# Altium schematic sheet 07_mPCIe_5-8.SchDoc: mPCIe 5 - 8 (XTRX)
size A3; Organization: Lime Microsystems; Address1: Surrey Tech Centre; Address2: Guildford GU2 7YG; Address3: Surrey; Address4: United Kingdom; Revision: v1.0; SheetNumber: 7; SheetTotal: 11
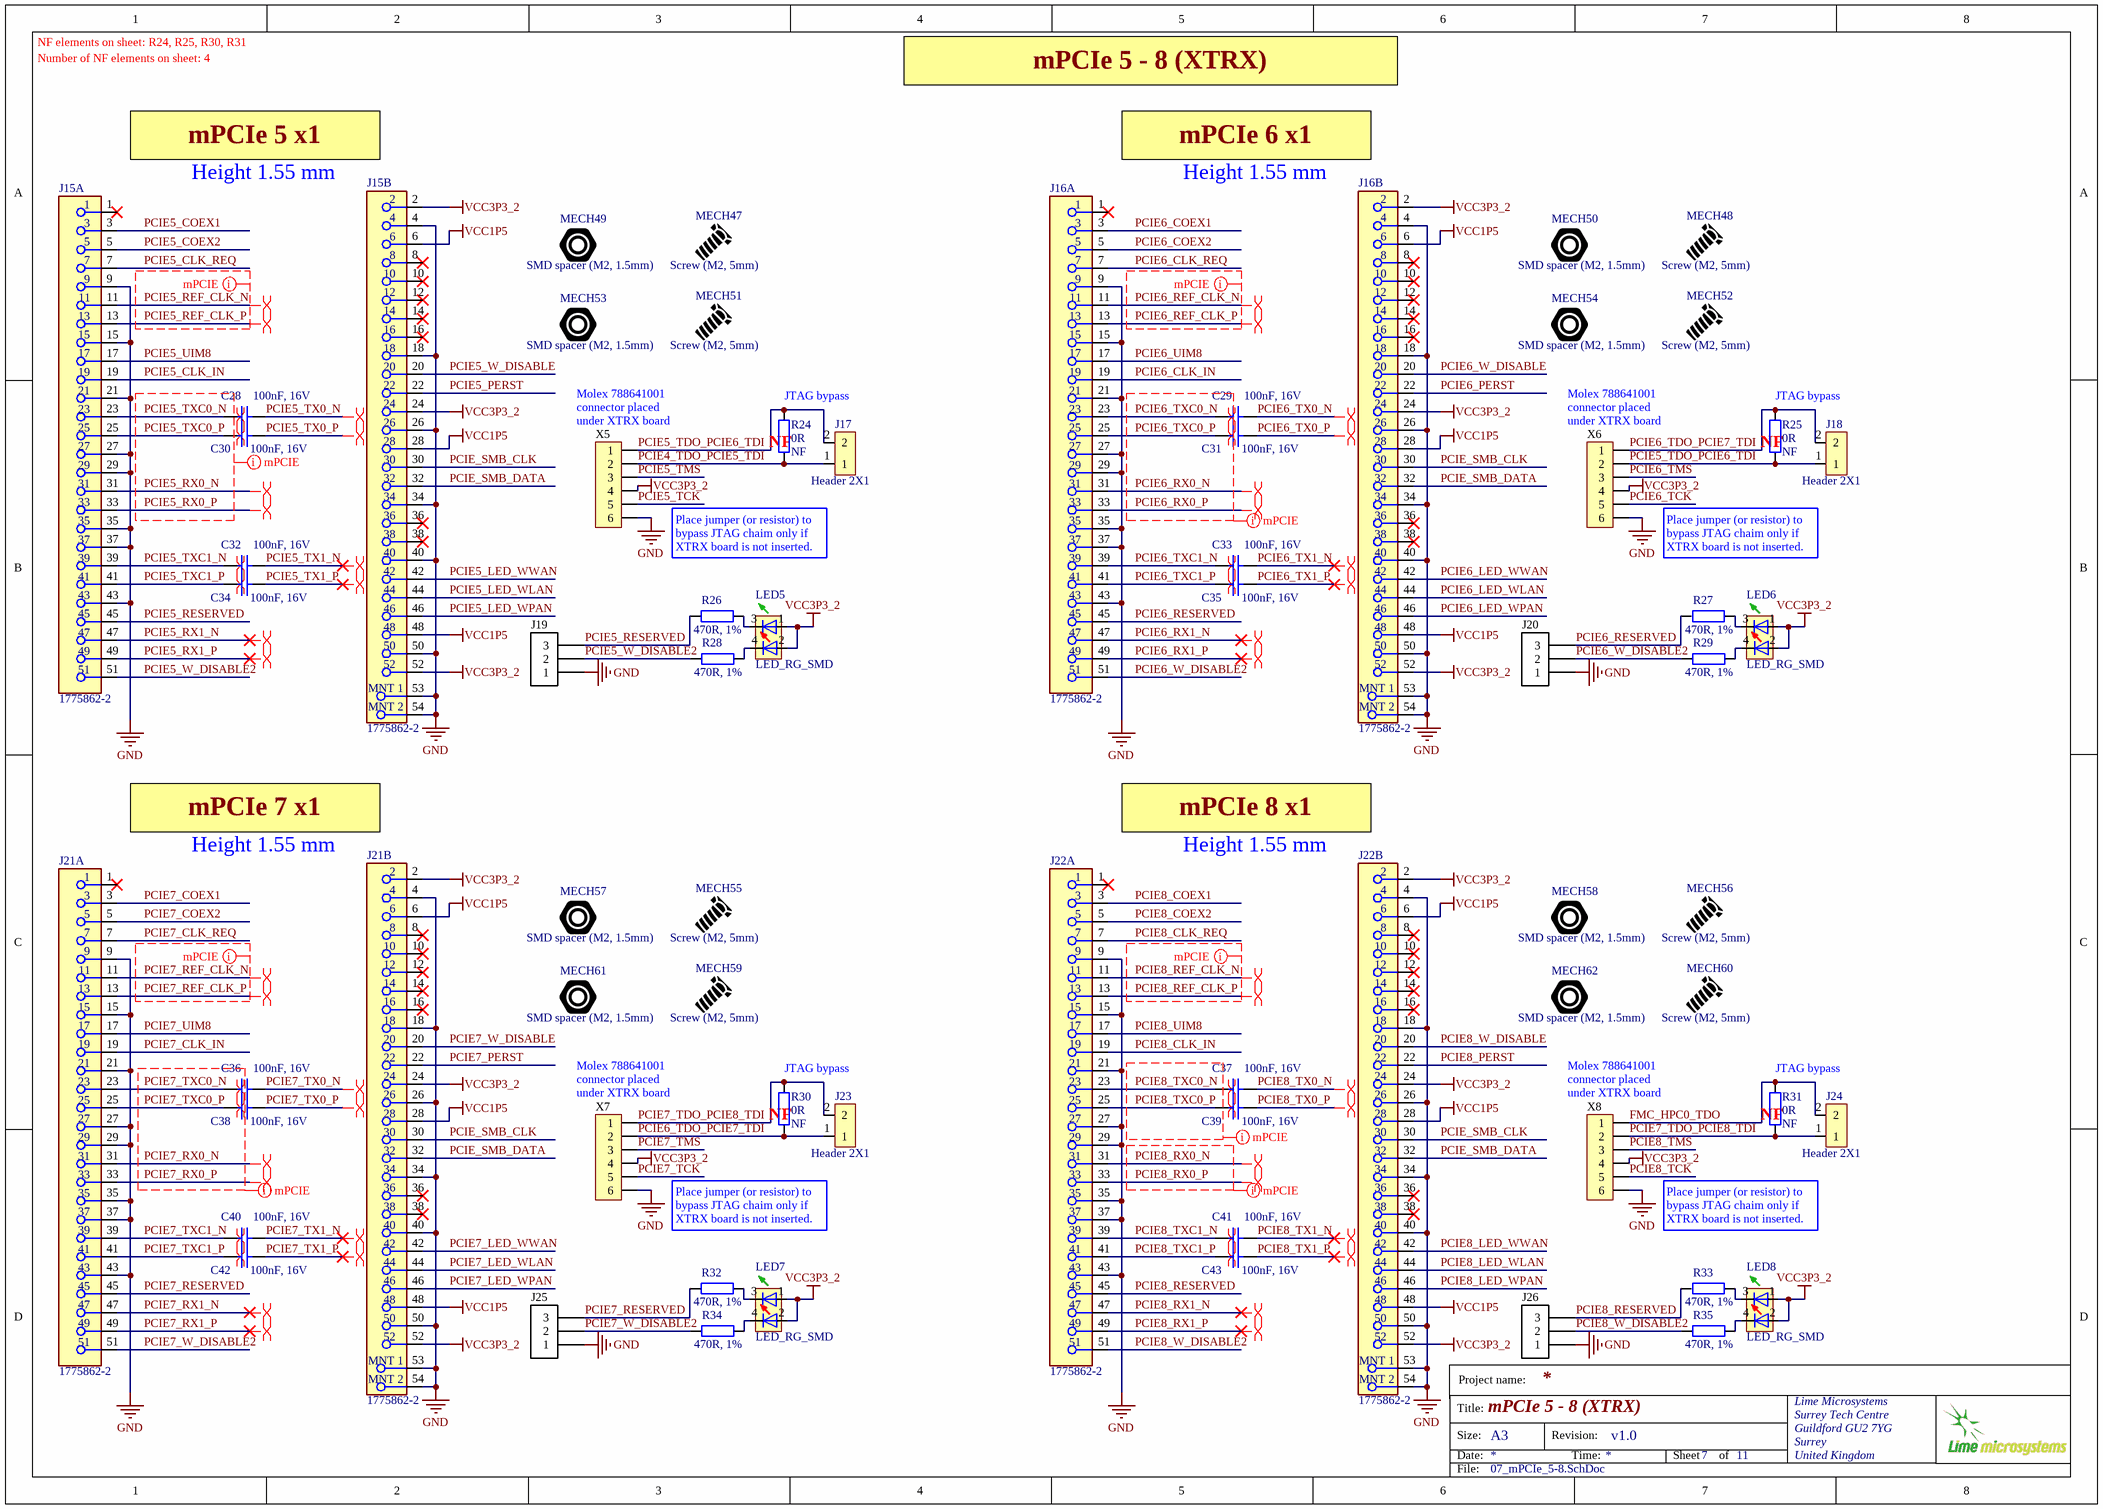
[diagram p0: 07_mPCIe_5-8.SchDoc]

## Parts
C28  100nF, 16V  [CAP0402]
C29  100nF, 16V  [CAP0402]
C30  100nF, 16V  [CAP0402]
C31  100nF, 16V  [CAP0402]
C32  100nF, 16V  [CAP0402]
C33  100nF, 16V  [CAP0402]
C34  100nF, 16V  [CAP0402]
C35  100nF, 16V  [CAP0402]
C36  100nF, 16V  [CAP0402]
C37  100nF, 16V  [CAP0402]
C38  100nF, 16V  [CAP0402]
C39  100nF, 16V  [CAP0402]
C40  100nF, 16V  [CAP0402]
C41  100nF, 16V  [CAP0402]
C42  100nF, 16V  [CAP0402]
C43  100nF, 16V  [CAP0402]
J15  1775862-2  [MiniPCIe_connector_XTRX]  (parts A,B of 2)
J16  1775862-2  [MiniPCIe_connector_XTRX]  (parts A,B of 2)
J17  Header 2X1  [HDR_1x2]
J18  Header 2X1  [HDR_1x2]
J19  Header 3x1 pin  [HDR_1x3]  (value not drawn)
J20  Header 3x1 pin  [HDR_1x3]  (value not drawn)
J21  1775862-2  [MiniPCIe_connector_XTRX]  (parts A,B of 2)
J22  1775862-2  [MiniPCIe_connector_XTRX]  (parts A,B of 2)
J23  Header 2X1  [HDR_1x2]
J24  Header 2X1  [HDR_1x2]
J25  Header 3x1 pin  [HDR_1x3]  (value not drawn)
J26  Header 3x1 pin  [HDR_1x3]  (value not drawn)
LED5  LED_RG_SMD  [LED-2x0603]
LED6  LED_RG_SMD  [LED-2x0603]
LED7  LED_RG_SMD  [LED-2x0603]
LED8  LED_RG_SMD  [LED-2x0603]
MECH47  Screw (M2, 5mm)  (mechanical)
MECH48  Screw (M2, 5mm)  (mechanical)
MECH49  SMD spacer (M2, 1.5mm)  (mechanical)
MECH50  SMD spacer (M2, 1.5mm)  (mechanical)
MECH51  Screw (M2, 5mm)  (mechanical)
MECH52  Screw (M2, 5mm)  (mechanical)
MECH53  SMD spacer (M2, 1.5mm)  (mechanical)
MECH54  SMD spacer (M2, 1.5mm)  (mechanical)
MECH55  Screw (M2, 5mm)  (mechanical)
MECH56  Screw (M2, 5mm)  (mechanical)
MECH57  SMD spacer (M2, 1.5mm)  (mechanical)
MECH58  SMD spacer (M2, 1.5mm)  (mechanical)
MECH59  Screw (M2, 5mm)  (mechanical)
MECH60  Screw (M2, 5mm)  (mechanical)
MECH61  SMD spacer (M2, 1.5mm)  (mechanical)
MECH62  SMD spacer (M2, 1.5mm)  (mechanical)
R24  0R  Assembly Info: NF  [RES0402]
R25  0R  Assembly Info: NF  [RES0402]
R26  470R, 1%  [RES0402]
R27  470R, 1%  [RES0402]
R28  470R, 1%  [RES0402]
R29  470R, 1%  [RES0402]
R30  0R  Assembly Info: NF  [RES0402]
R31  0R  Assembly Info: NF  [RES0402]
R32  470R, 1%  [RES0402]
R33  470R, 1%  [RES0402]
R34  470R, 1%  [RES0402]
R35  470R, 1%  [RES0402]
X5  Molex 0788641001  [Molex_0788641001_spring_contacts_carrier]  (value not drawn)
X6  Molex 0788641001  [Molex_0788641001_spring_contacts_carrier]  (value not drawn)
X7  Molex 0788641001  [Molex_0788641001_spring_contacts_carrier]  (value not drawn)
X8  Molex 0788641001  [Molex_0788641001_spring_contacts_carrier]  (value not drawn)

## Nets
GND: J15.4 J15.9 J15.15 J15.18 J15.21 J15.26 J15.27 J15.29 J15.34 J15.35 J15.37 J15.40 J15.43 J15.50 J15.53(MNT_1) J15.54(MNT_2) J16.4 J16.9 J16.15 J16.18 J16.21 J16.26 J16.27 J16.29 J16.34 J16.35 J16.37 J16.40 J16.43 J16.50 J16.53(MNT_1) J16.54(MNT_2) J19.1 J20.1 J21.4 J21.9 J21.15 J21.18 J21.21 J21.26 J21.27 J21.29 J21.34 J21.35 J21.37 J21.40 J21.43 J21.50 J21.53(MNT_1) J21.54(MNT_2) J22.4 J22.9 J22.15 J22.18 J22.21 J22.26 J22.27 J22.29 J22.34 J22.35 J22.37 J22.40 J22.43 J22.50 J22.53(MNT_1) J22.54(MNT_2) J25.1 J26.1 X5.6 X6.6 X7.6 X8.6
VCC1P5: J15.6 J15.28 J15.48 J16.6 J16.28 J16.48 J21.6 J21.28 J21.48 J22.6 J22.28 J22.48
VCC3P3_2: J15.2 J15.24 J15.52 J16.2 J16.24 J16.52 J21.2 J21.24 J21.52 J22.2 J22.24 J22.52 LED5.1 LED5.2 LED6.1 LED6.2 LED7.1 LED7.2 LED8.1 LED8.2 X5.4 X6.4 X7.4 X8.4
FMC_HPC0_TDO: J24.2 R31.1 X8.1
PCIE4_TDO_PCIE5_TDI: J17.1 R24.2 X5.2
PCIE5_CLK_IN: J15.19
PCIE5_CLK_REQ: J15.7
PCIE5_COEX1: J15.3
PCIE5_COEX2: J15.5
PCIE5_LED_WLAN: J15.44
PCIE5_LED_WPAN: J15.46
PCIE5_LED_WWAN: J15.42
PCIE5_PERST: J15.22
PCIE5_REF_CLK_N: J15.11
PCIE5_REF_CLK_P: J15.13
PCIE5_RESERVED: J15.45 J19.3 R26.2
PCIE5_RX0_N: J15.31
PCIE5_RX0_P: J15.33
PCIE5_RX1_N: J15.47
PCIE5_RX1_P: J15.49
PCIE5_TCK: X5.5
PCIE5_TDO_PCIE6_TDI: J17.2 J18.1 R24.1 R25.2 X5.1 X6.2
PCIE5_TMS: X5.3
PCIE5_TX0_N: C28.1
PCIE5_TX0_P: C30.1
PCIE5_TX1_N: C32.1
PCIE5_TX1_P: C34.1
PCIE5_TXC0_N: C28.2 J15.23
PCIE5_TXC0_P: C30.2 J15.25
PCIE5_TXC1_N: C32.2 J15.39
PCIE5_TXC1_P: C34.2 J15.41
PCIE5_UIM8: J15.17
PCIE5_W_DISABLE: J15.20
PCIE5_W_DISABLE2: J15.51 J19.2 R28.2
PCIE6_CLK_IN: J16.19
PCIE6_CLK_REQ: J16.7
PCIE6_COEX1: J16.3
PCIE6_COEX2: J16.5
PCIE6_LED_WLAN: J16.44
PCIE6_LED_WPAN: J16.46
PCIE6_LED_WWAN: J16.42
PCIE6_PERST: J16.22
PCIE6_REF_CLK_N: J16.11
PCIE6_REF_CLK_P: J16.13
PCIE6_RESERVED: J16.45 J20.3 R27.2
PCIE6_RX0_N: J16.31
PCIE6_RX0_P: J16.33
PCIE6_RX1_N: J16.47
PCIE6_RX1_P: J16.49
PCIE6_TCK: X6.5
PCIE6_TDO_PCIE7_TDI: J18.2 J23.1 R25.1 R30.2 X6.1 X7.2
PCIE6_TMS: X6.3
PCIE6_TX0_N: C29.1
PCIE6_TX0_P: C31.1
PCIE6_TX1_N: C33.1
PCIE6_TX1_P: C35.1
PCIE6_TXC0_N: C29.2 J16.23
PCIE6_TXC0_P: C31.2 J16.25
PCIE6_TXC1_N: C33.2 J16.39
PCIE6_TXC1_P: C35.2 J16.41
PCIE6_UIM8: J16.17
PCIE6_W_DISABLE: J16.20
PCIE6_W_DISABLE2: J16.51 J20.2 R29.2
PCIE7_CLK_IN: J21.19
PCIE7_CLK_REQ: J21.7
PCIE7_COEX1: J21.3
PCIE7_COEX2: J21.5
PCIE7_LED_WLAN: J21.44
PCIE7_LED_WPAN: J21.46
PCIE7_LED_WWAN: J21.42
PCIE7_PERST: J21.22
PCIE7_REF_CLK_N: J21.11
PCIE7_REF_CLK_P: J21.13
PCIE7_RESERVED: J21.45 J25.3 R32.2
PCIE7_RX0_N: J21.31
PCIE7_RX0_P: J21.33
PCIE7_RX1_N: J21.47
PCIE7_RX1_P: J21.49
PCIE7_TCK: X7.5
PCIE7_TDO_PCIE8_TDI: J23.2 J24.1 R30.1 R31.2 X7.1 X8.2
PCIE7_TMS: X7.3
PCIE7_TX0_N: C36.1
PCIE7_TX0_P: C38.1
PCIE7_TX1_N: C40.1
PCIE7_TX1_P: C42.1
PCIE7_TXC0_N: C36.2 J21.23
PCIE7_TXC0_P: C38.2 J21.25
PCIE7_TXC1_N: C40.2 J21.39
PCIE7_TXC1_P: C42.2 J21.41
PCIE7_UIM8: J21.17
PCIE7_W_DISABLE: J21.20
PCIE7_W_DISABLE2: J21.51 J25.2 R34.2
PCIE8_CLK_IN: J22.19
PCIE8_CLK_REQ: J22.7
PCIE8_COEX1: J22.3
PCIE8_COEX2: J22.5
PCIE8_LED_WLAN: J22.44
PCIE8_LED_WPAN: J22.46
PCIE8_LED_WWAN: J22.42
PCIE8_PERST: J22.22
PCIE8_REF_CLK_N: J22.11
PCIE8_REF_CLK_P: J22.13
PCIE8_RESERVED: J22.45 J26.3 R33.2
PCIE8_RX0_N: J22.31
PCIE8_RX0_P: J22.33
PCIE8_RX1_N: J22.47
PCIE8_RX1_P: J22.49
PCIE8_TCK: X8.5
PCIE8_TMS: X8.3
PCIE8_TX0_N: C37.1
PCIE8_TX0_P: C39.1
PCIE8_TX1_N: C41.1
PCIE8_TX1_P: C43.1
PCIE8_TXC0_N: C37.2 J22.23
PCIE8_TXC0_P: C39.2 J22.25
PCIE8_TXC1_N: C41.2 J22.39
PCIE8_TXC1_P: C43.2 J22.41
PCIE8_UIM8: J22.17
PCIE8_W_DISABLE: J22.20
PCIE8_W_DISABLE2: J22.51 J26.2 R35.2
PCIE_SMB_CLK: J15.30 J16.30 J21.30 J22.30
PCIE_SMB_DATA: J15.32 J16.32 J21.32 J22.32
NetLED5_3: LED5.3 R26.1
NetLED5_4: LED5.4 R28.1
NetLED6_3: LED6.3 R27.1
NetLED6_4: LED6.4 R29.1
NetLED7_3: LED7.3 R32.1
NetLED7_4: LED7.4 R34.1
NetLED8_3: LED8.3 R33.1
NetLED8_4: LED8.4 R35.1

Not connected (* = marked no-connect by the designer): J15 1* 8* 10* 12* 14* 16* 36* 38*; J16 1* 8* 10* 12* 14* 16* 36* 38*; J21 1* 8* 10* 12* 14* 16* 36* 38*; J22 1* 8* 10* 12* 14* 16* 36* 38*

## Layout directives
differential pair: PCIE5_REF_CLK_N, PCIE5_REF_CLK_P, PCIE5_RX0_N, PCIE5_RX0_P, PCIE5_RX1_N, PCIE5_RX1_P, PCIE5_TX0_N, PCIE5_TX0_P, PCIE5_TX1_N, PCIE5_TX1_P, PCIE5_TXC0_N, PCIE5_TXC0_P, PCIE5_TXC1_N, PCIE5_TXC1_P, PCIE6_REF_CLK_N, PCIE6_REF_CLK_P, PCIE6_RX0_N, PCIE6_RX0_P, PCIE6_RX1_N, PCIE6_RX1_P, PCIE6_TX0_N, PCIE6_TX0_P, PCIE6_TX1_N, PCIE6_TX1_P, PCIE6_TXC0_N, PCIE6_TXC0_P, PCIE6_TXC1_N, PCIE6_TXC1_P, PCIE7_REF_CLK_N, PCIE7_REF_CLK_P, PCIE7_RX0_N, PCIE7_RX0_P, PCIE7_RX1_N, PCIE7_RX1_P, PCIE7_TX0_N, PCIE7_TX0_P, PCIE7_TX1_N, PCIE7_TX1_P, PCIE7_TXC0_N, PCIE7_TXC0_P, PCIE7_TXC1_N, PCIE7_TXC1_P, PCIE8_REF_CLK_N, PCIE8_REF_CLK_P, PCIE8_RX0_N, PCIE8_RX0_P, PCIE8_RX1_N, PCIE8_RX1_P, PCIE8_TX0_N, PCIE8_TX0_P, PCIE8_TX1_N, PCIE8_TX1_P, PCIE8_TXC0_N, PCIE8_TXC0_P, PCIE8_TXC1_N, PCIE8_TXC1_P
net class mPCIE: PCIE5_REF_CLK_N, PCIE5_REF_CLK_P, PCIE5_RX0_N, PCIE5_RX0_P, PCIE5_TXC0_N, PCIE5_TXC0_P, PCIE6_REF_CLK_N, PCIE6_REF_CLK_P, PCIE6_RX0_N, PCIE6_RX0_P, PCIE6_TXC0_N, PCIE6_TXC0_P, PCIE7_REF_CLK_N, PCIE7_REF_CLK_P, PCIE7_RX0_N, PCIE7_RX0_P, PCIE7_TXC0_N, PCIE7_TXC0_P, PCIE8_REF_CLK_N, PCIE8_REF_CLK_P, PCIE8_RX0_N, PCIE8_RX0_P, PCIE8_TXC0_N, PCIE8_TXC0_P

## Notes on the sheet
- NF elements on sheet: R24, R25, R30, R31
- Number of NF elements on sheet: 4
- mPCIe 5 - 8 (XTRX)
- mPCIe 5 x1
- Height 1.55 mm
- mPCIe 6 x1
- (near X5) Molex 788641001 connector placed under XTRX board
- (near R24) NF
- (near R24) JTAG bypass
- (near X6) Molex 788641001 connector placed under XTRX board
- (near R25) NF
- (near R25) JTAG bypass
- Place jumper (or resistor) to bypass JTAG chaim only if XTRX board is not inserted.
- mPCIe 7 x1
- mPCIe 8 x1
- (near X7) Molex 788641001 connector placed under XTRX board
- (near R30) NF
- (near R30) JTAG bypass
- (near X8) Molex 788641001 connector placed under XTRX board
- (near R31) NF
- (near R31) JTAG bypass
- Project name:
- Title:
- Size:
- Date:
- A3
- Revision:
- Time:
- Sheet
- of
- File:

## Library data of the parts
C28-C43 = Cap_0402: Manufacturer: Murata Electronics; Manufacturer Part Number: GRM155R71C104KA88D; Part Description: 0.10µF ±10% 16V X7R Ceramic Capacitor -55°C ~ 125°C Surface Mount, MLCC 0402 (1005 Metric) 0.039" L x 0.020" W (1.00mm x 0.50mm); Tolerance: 10 %; Type: General Purpose MLCC; Capacitance: 0.1 uF; Case Length: 1 mm; Dielectric: X7R; Case Height: 0.5 mm; Temperature Coefficient / Code: +/- 15 %; Value: 100nF, 16V; Supplier 1: Mouser; Supplier Part Number 1: 81-GRM155R71C104KA88; Case Code - in: 0402; RoHS: RoHS Compliant; Operating Temperature Range: - 55 C to + 125 C; Series: GRM; Termination Style: SMD/SMT; Package / Case: 0402 (1005 metric); Voltage Rating DC: 16 V; Maximum Operating Temperature: + 125 C; Case Code - mm: 1005; Minimum Operating Temperature: - 55 C; Product Category: Low & Medium Capacitance SMD Ceramic Chip Capacitors; Packaging: Reel; Product: General Type MLCCs; Category: Multilayer Ceramic Capacitors MLCC - SMD/SMT; Brand: Murata Electronics; Case Width: 0.5 mm; RoHS - Mouser: Y; Standard Pack Qty: 10000; Minimum Order Quantity: 1; Reeling: True; Manufacturer Part Number 1: GRM155R71C104KA88D
J15 J16 J21 J22 = MINI_PCIE_FEMALE: CONN PCI EXP MINI FEMALE 52POS; Manufacturer: JAE Electronics; Manufacturer Part Number 1: MM60-52B1-G1-R850; Part Description: 52 Position Female Connector PCI Express Mini Card Gold 0.031" (0.80mm); ComponentLink1URL: https://www.mouser.com/ds/2/418/NG_DS_8-1773459-7_EXPRESS_MINI_CARD_QRG_0816-907003.pdf?src-supplier=Mouser; ComponentLink1Description: https://www.mouser.com/ds/2/418/NG_DS_8-1773459-7_EXPRESS_MINI_CARD_QRG_0816-907003.pdf?src-supplier=Mouser; ComponentLink2URL: http://www.farnell.com/datasheets/2645681.pdf?src-supplier=Newark; ComponentLink2Description: http://www.farnell.com/datasheets/2645681.pdf?src-supplier=Newark; ComponentLink3URL: https://www.te.com/commerce/DocumentDelivery/DDEController?Action=srchrtrv&DocNm=108-99102&DocType=SS&DocLang=EN&src-supplier=Digi-Key; ComponentLink3Description: https://www.te.com/commerce/DocumentDelivery/DDEController?Action=srchrtrv&DocNm=108-99102&DocType=SS&DocLang=EN&src-supplier=Digi-Key; ComponentLink4URL: https://www.te.com/commerce/DocumentDelivery/DDEController?Action=srchrtrv&amp;DocNm=108-99102&amp;DocType=SS&amp;DocLang=EN&src-supplier=Digi-Key; ComponentLink4Description: https://www.te.com/commerce/DocumentDelivery/DDEController?Action=srchrtrv&amp;DocNm=108-99102&amp;DocType=SS&amp;DocLang=EN&src-supplier=Digi-Key; ComponentLink5URL: http://www.te.com/commerce/DocumentDelivery/DDEController?Action=showdoc&DocId=Customer+Drawing%7F2041262%7FC%7Fpdf%7FEnglish%7FENG_CD_2041262_C.pdf&src-supplier=Avnet; ComponentLink5Description: http://www.te.com/commerce/DocumentDelivery/DDEController?Action=showdoc&DocId=Customer+Drawing%7F2041262%7FC%7Fpdf%7FEnglish%7FENG_CD_2041262_C.pdf&src-supplier=Avnet; ComponentLink6URL: http://www.te.com/commerce/DocumentDelivery/DDEController?Action=srchrtrv&DocNm=2041262&DocType=Customer+Drawing&DocLang=English&src-supplier=Digi-Key; ComponentLink6Description: http://www.te.com/commerce/DocumentDelivery/DDEController?Action=srchrtrv&DocNm=2041262&DocType=Customer+Drawing&DocLang=English&src-supplier=Digi-Key; Supplier 1: Digi-Key; Supplier Part Number 1: 670-2516-1-ND; Stock 1: 30104; Pricing 1: 1=1,45000, 10=1,26500, 25=1,21120, 50=1,18440, 100=1,13060, 250=1,02292 (USD); RoHS: Yes; ComponentLink7URL: https://datasheet.ciiva.com/417/sj110634-417626.pdf?src-supplier=Digi-Key; ComponentLink7Description: https://datasheet.ciiva.com/417/sj110634-417626.pdf?src-supplier=Digi-Key; ComponentLink8URL: https://datasheet.ciiva.com/417/sj110634-417627.pdf?src-supplier=Digi-Key; ComponentLink8Description: https://datasheet.ciiva.com/417/sj110634-417627.pdf?src-supplier=Digi-Key; ComponentLink9URL: https://datasheet.ciiva.com/417/sj110634-417628.pdf?src-supplier=Digi-Key; ComponentLink9Description: https://datasheet.ciiva.com/417/sj110634-417628.pdf?src-supplier=Digi-Key; ComponentLink10URL: https://datasheet.ciiva.com/14644/70040279-14644764.pdf?src-supplier=Allied+Electronics; ComponentLink10Description: https://datasheet.ciiva.com/14644/70040279-14644764.pdf?src-supplier=Allied+Electronics
J17 J18 J23 J24 = Jumper: Manufacturer Part Number 1: 961102-6404-AR; Part Description: 2 Positions Header, Unshrouded Connector 0.100" (2.54mm) Through Hole Gold; Manufacturer: 3M; Connector Type: Header, Unshrouded; Supplier 1: Digi-Key; Supplier Part Number 1: 3M9447-ND; Contact Type: Male Pin; Color: Black; Mounting Type: Through Hole; Category: Connectors, Interconnects; Contact Finish: Gold
J19 J20 J25 J26 = Header3P: Header, 3-pin; Manufacturer 1: Wurth Electronics; Manufacturer Part Number: 61300311121; Part Description: Connector Header Through Hole 3 position 0.100" (2.54mm); Number of Positions: 3; Gender: Male; Connector Type: Male Pin; Pitch: 0.1inch; Supplier 1: Digi-Key; Supplier Part Number 1: 732-5316-ND; Stock 1: 95926; Pricing 1: 1=0,13000, 10=0,11300, 25=0,09400, 50=0,07900, 100=0,07100, 1000=0,06600 (USD); RoHS: Yes; Mount: Through Hole; Contact Plating: Gold; Contact Material: Copper; Color: Black; Number of Rows: 1; Packaging: Bulk; Termination: Solder; Number of Contacts: 3; Contact Mating Length: 0.236inch; REACH SVHC: Unknown; Lead Free: Lead Free; RoHS Compliant: Yes; ComponentLink1URL: http://www.farnell.com/cad/1737268.pdf?src-supplier=Element14; ComponentLink1Description: http://www.farnell.com/cad/1737268.pdf?src-supplier=Element14; ComponentLink2URL: https://katalog.we-online.de/em/datasheet/6130xx11121.pdf?src-supplier=Digi-Key; ComponentLink2Description: https://katalog.we-online.de/em/datasheet/6130xx11121.pdf?src-supplier=Digi-Key; Manufacturer: Wurth Electronics; Manufacturer Part Number 1: 61300311121
LED5-LED8 = LED_green_red_SMD: Manufacturer Part Number 1: HSMF-C165; Manufacturer: Avago Technologies US Inc.; Part Description: LED GREEN/RED DIFFUSED 0603 SMD; Millicandela Rating: 15mcd Green, 10mcd Red; Lens Transparency: Diffused; Lens Color: White; Lens Style/Size: Rectangle with Flat Top, 1.60mm x 0.80mm; Wavelength - Peak: 570nm Green, 636nm Red; Wavelength - Dominant: 572nm Green, 621nm Red; Viewing Angle: 120°; Voltage - Forward (Vf) (Typ): 2.2V Green, 1.95V Red; Current - Test: 20mA; Color: Green, Red; Supplier 1: Digi-Key; Height (Max): 0.50mm; Packaging: Cut Tape (CT); Category: Optoelectronics; Mounting Type: Surface Mount; Package / Case: 0603 (1608 Metric); Size / Dimension: 1.60mm L x 0.80mm W; Supplier Device Package: *; RoHS: RoHS Compliant; Supplier Part Number 1: 516-1419-1-ND
MECH47 MECH48 MECH51 MECH52 MECH55 MECH56 MECH59 MECH60 = Universal_mech_screw: Part Description: M2x0.4 Pan Head Machine Screw Phillips Drive; Manufacturer: B&F Fastener; Manufacturer Part Number 1: MPMS0020005PH; Plating: Zinc; Head Diameter: 0.152inch; Head Height: 0.06inch; Supplier 1: Digi-Key; Supplier Part Number 1: H738-ND; Stock 1: 0; RoHS: Yes; Mount: Screw; Package Quantity: 100; Length: 0.257inch; Thread Size: M2; ComponentLink1URL: https://datasheet.ciiva.com/1034/metd7985a-1034171.pdf?src-supplier=Digi-Key; ComponentLink1Description: https://datasheet.ciiva.com/1034/metd7985a-1034171.pdf?src-supplier=Digi-Key
MECH49 MECH50 MECH53 MECH54 MECH57 MECH58 MECH61 MECH62 = Universal_mech_nut: Part Description: RND STANDOFF M2X0.4 STEEL 1.5MM; Manufacturer: Wurth Electronics; Manufacturer Part Number 1: 9774015243R; Plating: Tin; Threaded/Unthreaded: Threaded; Outside Diameter: 0.171inch; Thread Size: M2X0.4; Supplier 1: Digi-Key; Supplier Part Number 1: 732-7069-1-ND; Stock 1: 71623; Pricing 1: 1=1,16000, 10=1,09800, 50=0,97900, 100=0,89500, 500=0,83500 (USD); RoHS: Yes; Material: Steel; Series: WA-SMSI; Length: 0.114inch; ComponentLink1URL: http://www.mouser.com/ds/2/445/9774015243R-611439.pdf?src-supplier=Mouser; ComponentLink1Description: http://www.mouser.com/ds/2/445/9774015243R-611439.pdf?src-supplier=Mouser; ComponentLink2URL: https://media.digikey.com/pdf/Data%20Sheets/Wurth%20Electronics%20PDFs/WA-SMSx_Performance_Flyer.pdf?src-supplier=Digi-Key; ComponentLink2Description: https://media.digikey.com/pdf/Data%20Sheets/Wurth%20Electronics%20PDFs/WA-SMSx_Performance_Flyer.pdf?src-supplier=Digi-Key; ComponentLink3URL: http://www.farnell.com/datasheets/1960361.pdf?src-supplier=Farnell; ComponentLink3Description: http://www.farnell.com/datasheets/1960361.pdf?src-supplier=Farnell; ComponentLink4URL: http://www.farnell.com/datasheets/1960361.pdf?src-supplier=Element14; ComponentLink4Description: http://www.farnell.com/datasheets/1960361.pdf?src-supplier=Element14; ComponentLink5URL: http://www.farnell.com/datasheets/1960361.pdf?src-supplier=Newark; ComponentLink5Description: http://www.farnell.com/datasheets/1960361.pdf?src-supplier=Newark; ComponentLink6URL: https://katalog.we-online.de/em/datasheet/9774015243R.pdf?src-supplier=Digi-Key; ComponentLink6Description: https://katalog.we-online.de/em/datasheet/9774015243R.pdf?src-supplier=Digi-Key
R24 R25 R30 R31 = Res_0402: Manufacturer Part Number 1: RC0402JR-070RL; Manufacturer: Yageo; Part Description: RES SMD 0.0OHM JUMPER 1/16W 0402; Resistance (Ohms): 0.0; Tolerance: Jumper; Power (Watts): 0.063W, 1/16W; Value: 0R; Supplier 1: Digi-Key; Supplier Part Number 1: 311-0.0JRTR-ND; Category: Resistors; Temperature Coefficient: -; Features: Moisture Resistant; Supplier Device Package: 0402; Height: 0.016" (0.40mm); Package / Case: 0402 (1005 Metric); Operating Temperature: -55°C ~ 155°C; Size / Dimension: 0.039" L x 0.020" W (1.00mm x 0.50mm); Composition: Thick Film; Packaging: Tape & Reel (TR); Number of Terminations: 2; RoHS: RoHS Compliant
R26-R29 R32-R35 = Res_0402: Manufacturer 1: Yageo; Manufacturer Part Number 1: RC0402FR-07470RL; Part Description: 470 Ohms ±1% 0.063W, 1/16W Chip Resistor 0402 (1005 Metric) Moisture Resistant Thick Film; Power Rating: 62.5mW; Temperature Coefficient: 100ppm/°C; Voltage Rating: 50V; Max Power Dissipation: 63mW; Value: 470R, 1%; Supplier 1: Digi-Key; Supplier Part Number 1: 311-470LRCT-ND; Stock 1: 1652476; Pricing 1: 1=0,10000, 10=0,01600, 100=0,00660, 1000=0,00299, 2500=0,00259, 5000=0,00214 (USD); RoHS: Yes; Case/Package: 0402; Case Code (Metric): 1005; Case Code (Imperial): 0402; Size Code: 0402; Min Operating Temperature: -55°C; Max Operating Temperature: 155°C; Packaging: Tape and Reel; Tolerance: 1%; Resistance: 470R; Number of Terminations: 2; Features: Moisture Resistant; Package Quantity: 1; Resistor Type: Thick Film; Termination: SMD/SMT; Series: RC; Resistance Tolerance: 1%; Construction: Rectangular; Length: 1mm; Width: 0.02inch; Height: 0.016inch; Depth: 0.5mm; Lead Free: Lead Free; REACH SVHC: Unknown; Military Standard: Not; RoHS Compliant: Yes; Manufacturer: Yageo
X5-X8 = Molex_0788641001_spring_contacts: Header, 6-pin; Part Description: 6 Position Spring Battery Contact Connector Surface Mount; Manufacturer Part Number 1: 78864-1001; Voltage Rating: 10V; Number of Contacts: 6; Glow Wire Compliant: Non-compliant; Supplier 1: Digi-Key; Supplier Part Number 1: WM11204CT-ND; Manufacturer: Molex; Stock 1: 133097; Pricing 1: 1=0,45000, 10=0,36500, 100=0,26730, 1000=0,21263 (USD); RoHS: Yes; Contact Material: Copper Alloy; Orientation: Vertical; Voltage Rating (DC): 10V; Number of Circuits: 6; Halogen Free: Low Halogen; ComponentLink1URL: http://www.farnell.com/datasheets/2216617.pdf?src-supplier=Farnell; ComponentLink1Description: http://www.farnell.com/datasheets/2216617.pdf?src-supplier=Farnell; ComponentLink2URL: http://www.farnell.com/datasheets/2216617.pdf?src-supplier=Newark; ComponentLink2Description: http://www.farnell.com/datasheets/2216617.pdf?src-supplier=Newark; ComponentLink3URL: http://www.farnell.com/datasheets/1862322.pdf?src-supplier=Element14; ComponentLink3Description: http://www.farnell.com/datasheets/1862322.pdf?src-supplier=Element14